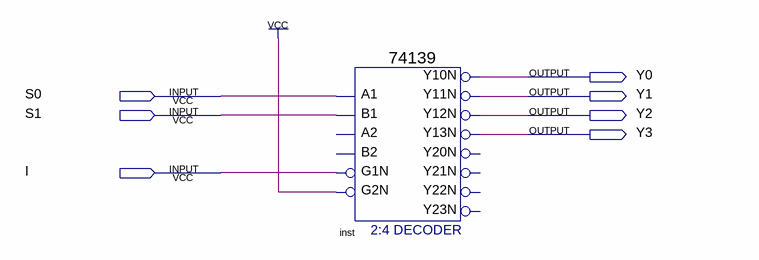
[diagram p0: schematic sheet]
// Quartus schematic one_to_four_Demux_seven_four_one_three_nine.bdf as structural Verilog: 1 symbols, 7 pins
module one_to_four_Demux_seven_four_one_three_nine (
  input  S0,
  input  S1,
  input  I,
  output Y0,
  output Y1,
  output Y2,
  output Y3
);

  \74139  inst (
    .A1(S0), .B1(S1), .G1N(I), .G2N(1'b1), .Y10N(Y0), .Y13N(Y3), .Y12N(Y2), .Y11N(Y1));  // open: A2, B2, Y20N, Y21N, Y22N, Y23N
endmodule
